# EAGLE design Grove - Tilt Switch v1.1 (EAGLE 6.4)

## Sheet 1 of 2
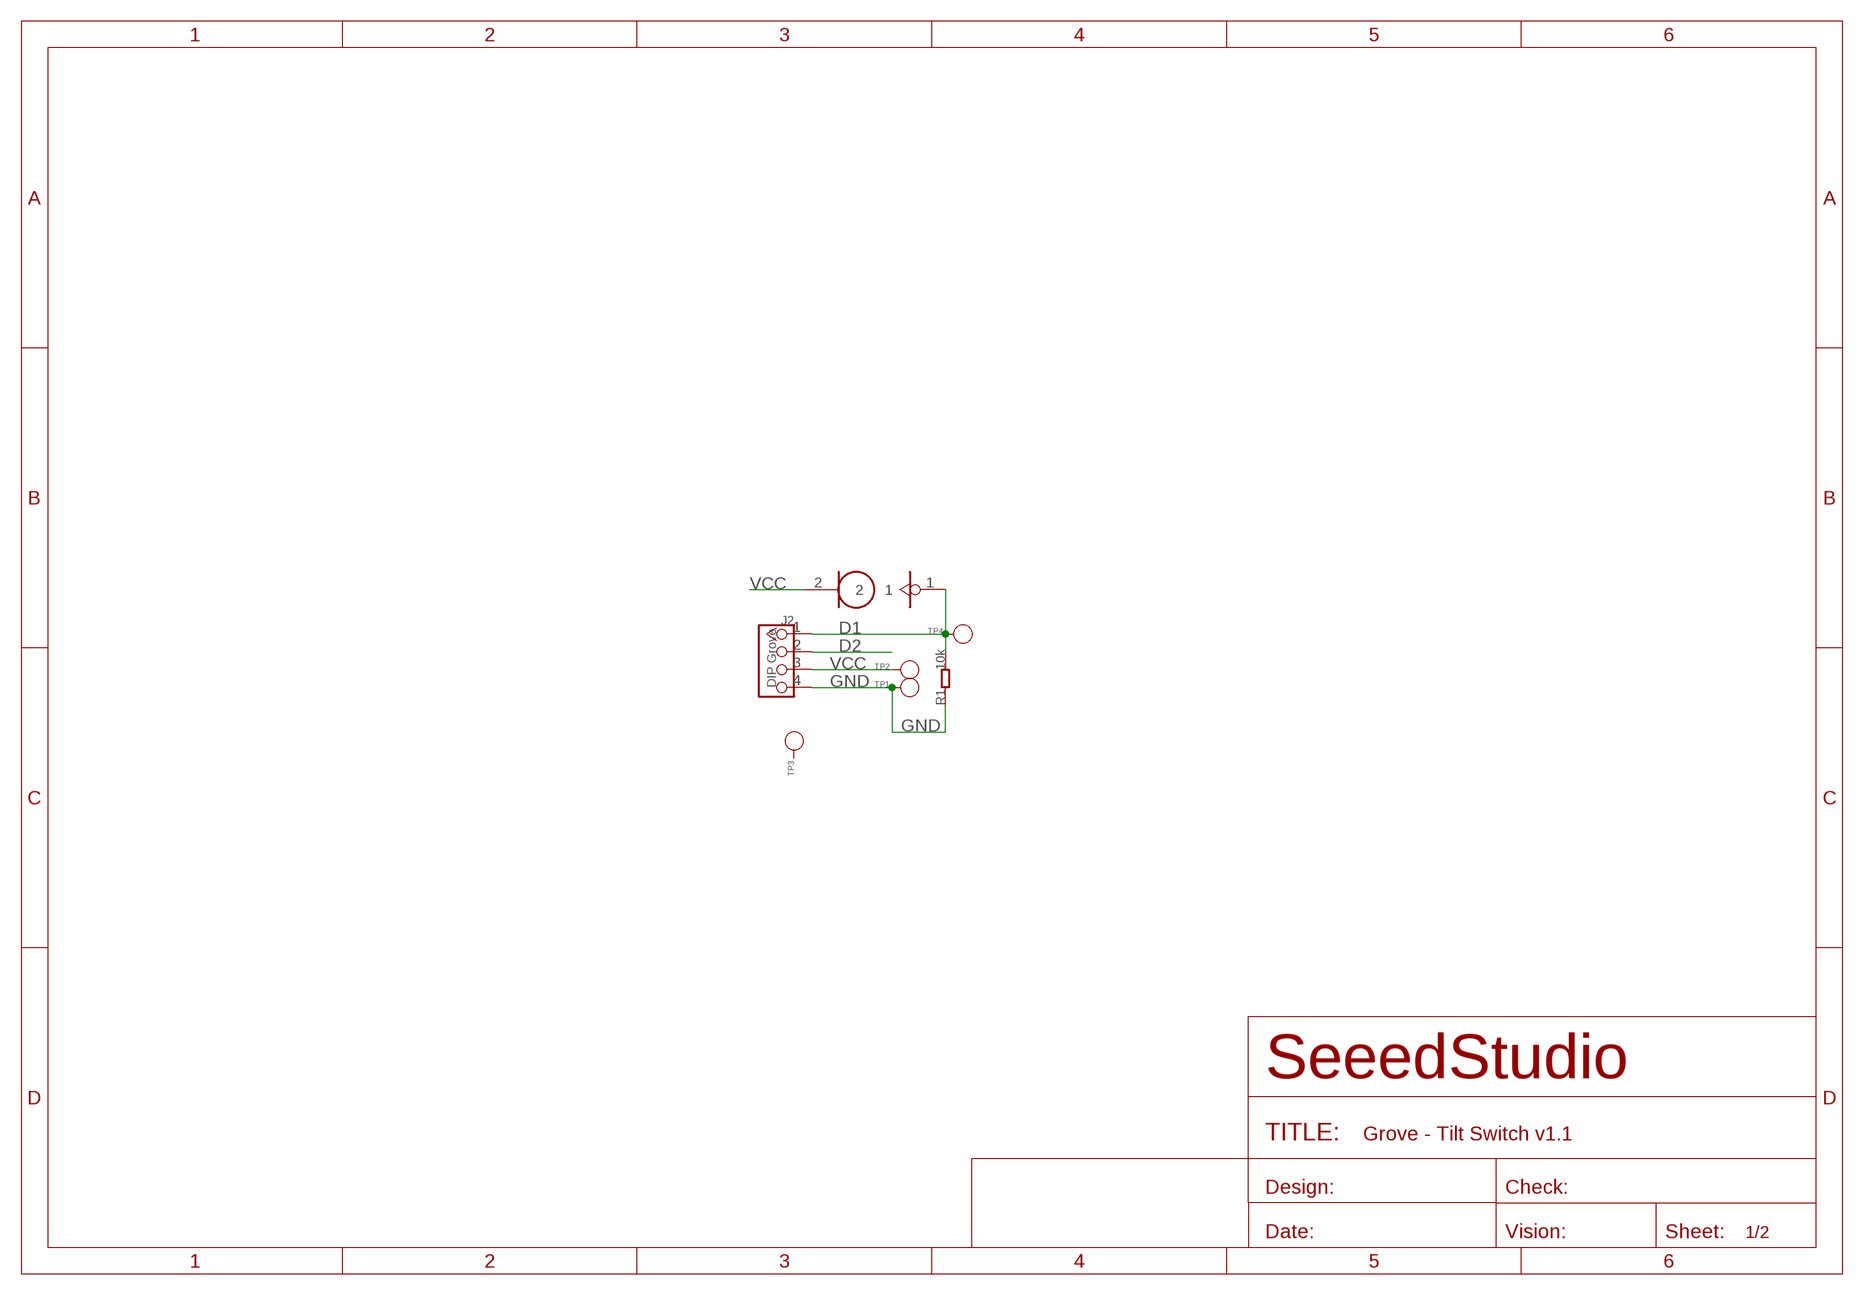
[diagram p0: schematic, sheet 1]

### Parts
J1  TILT  [TILT]
J2  DIP Grove  TWIG-4P-2.0-2.0  [4P-2.0]
R1  10k  005-R0603  [0603]
TP1  PAD-TEST-POINT'4545'  [TP_4545]
TP2  PAD-TEST-POINT'4545'  [TP_4545]
TP3  PAD-TEST-POINT'4545'  [TP_4545]
TP4  PAD-TEST-POINT'4545'  [TP_4545]

### Nets
D1: J1.1 J2.1 R1.2 TP4.T
D2: J2.2
GND: J2.4 R1.1 TP1.T
VCC: J1.2 J2.3 TP2.T
Unconnected: TP3.T

## Sheet 2 of 2
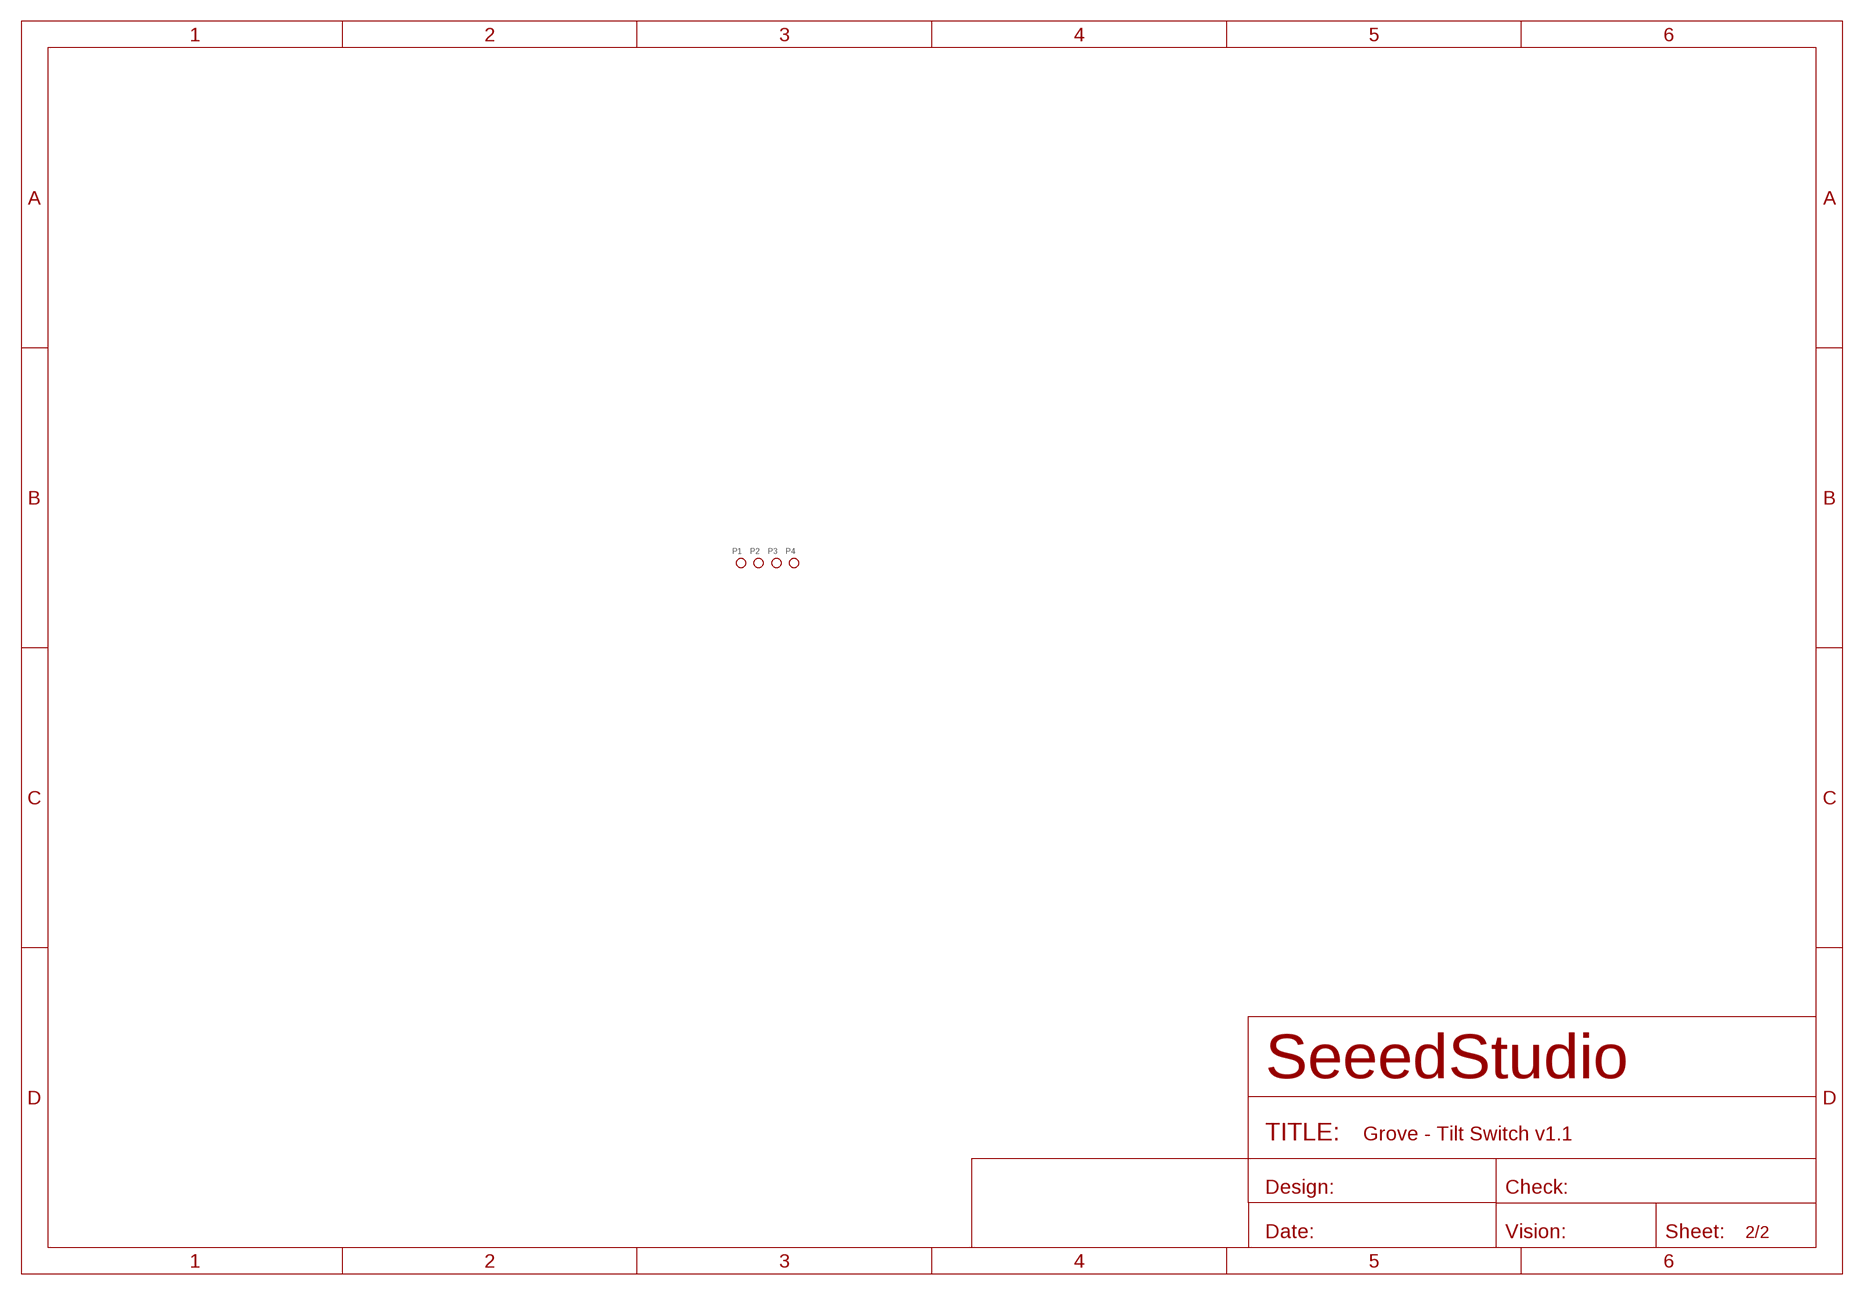
[diagram p1: schematic, sheet 2]

### Parts
P1  PAD-MARK  [ROUND-MARK-1.0]
P2  PAD-MARK  [ROUND-MARK-1.0]
P3  PAD-MARK  [ROUND-MARK-1.0]
P4  PAD-MARK  [ROUND-MARK-1.0]

## Library data of the parts
J1 = Seeed:TILT
J2 = Connector:TWIG-4P-2.0
P1-P4 = Discrete:PAD-MARK; PARTNO: DNP
R1 = Discrete:005-R*
TP1-TP4 = Discrete:PAD-TEST-POINT; PARTNO: DNP

## Board
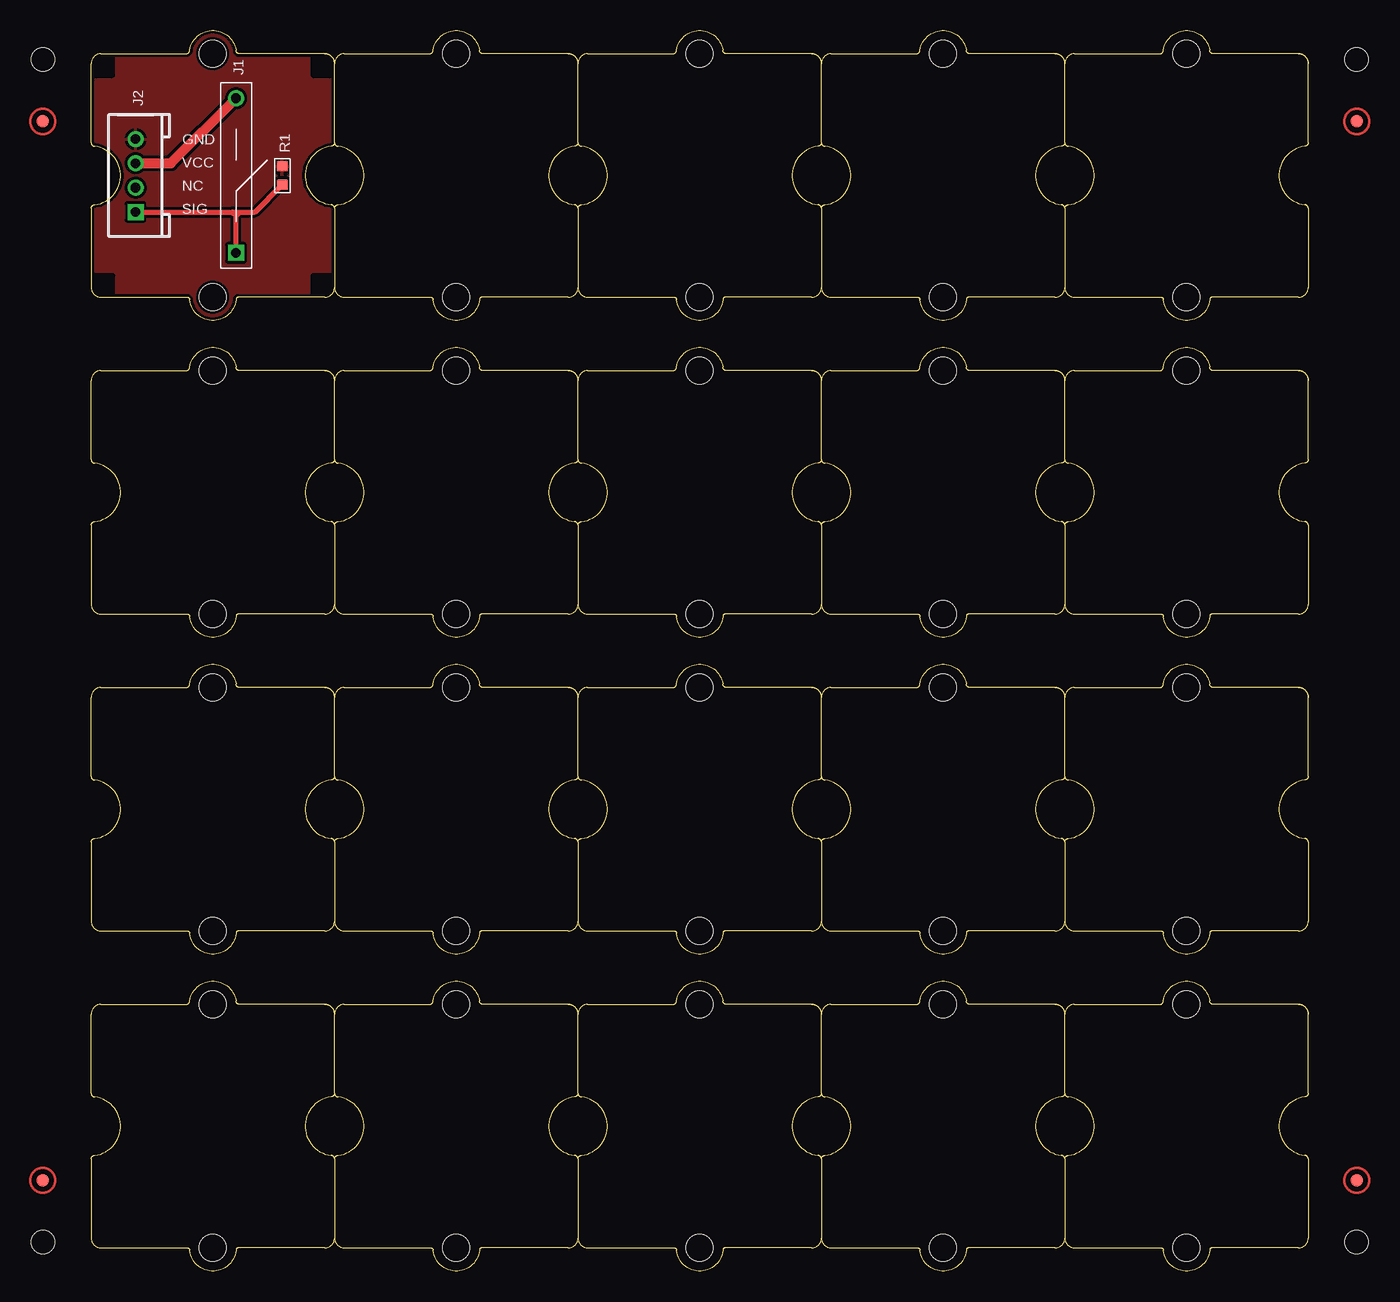
[diagram p2: board, top side]
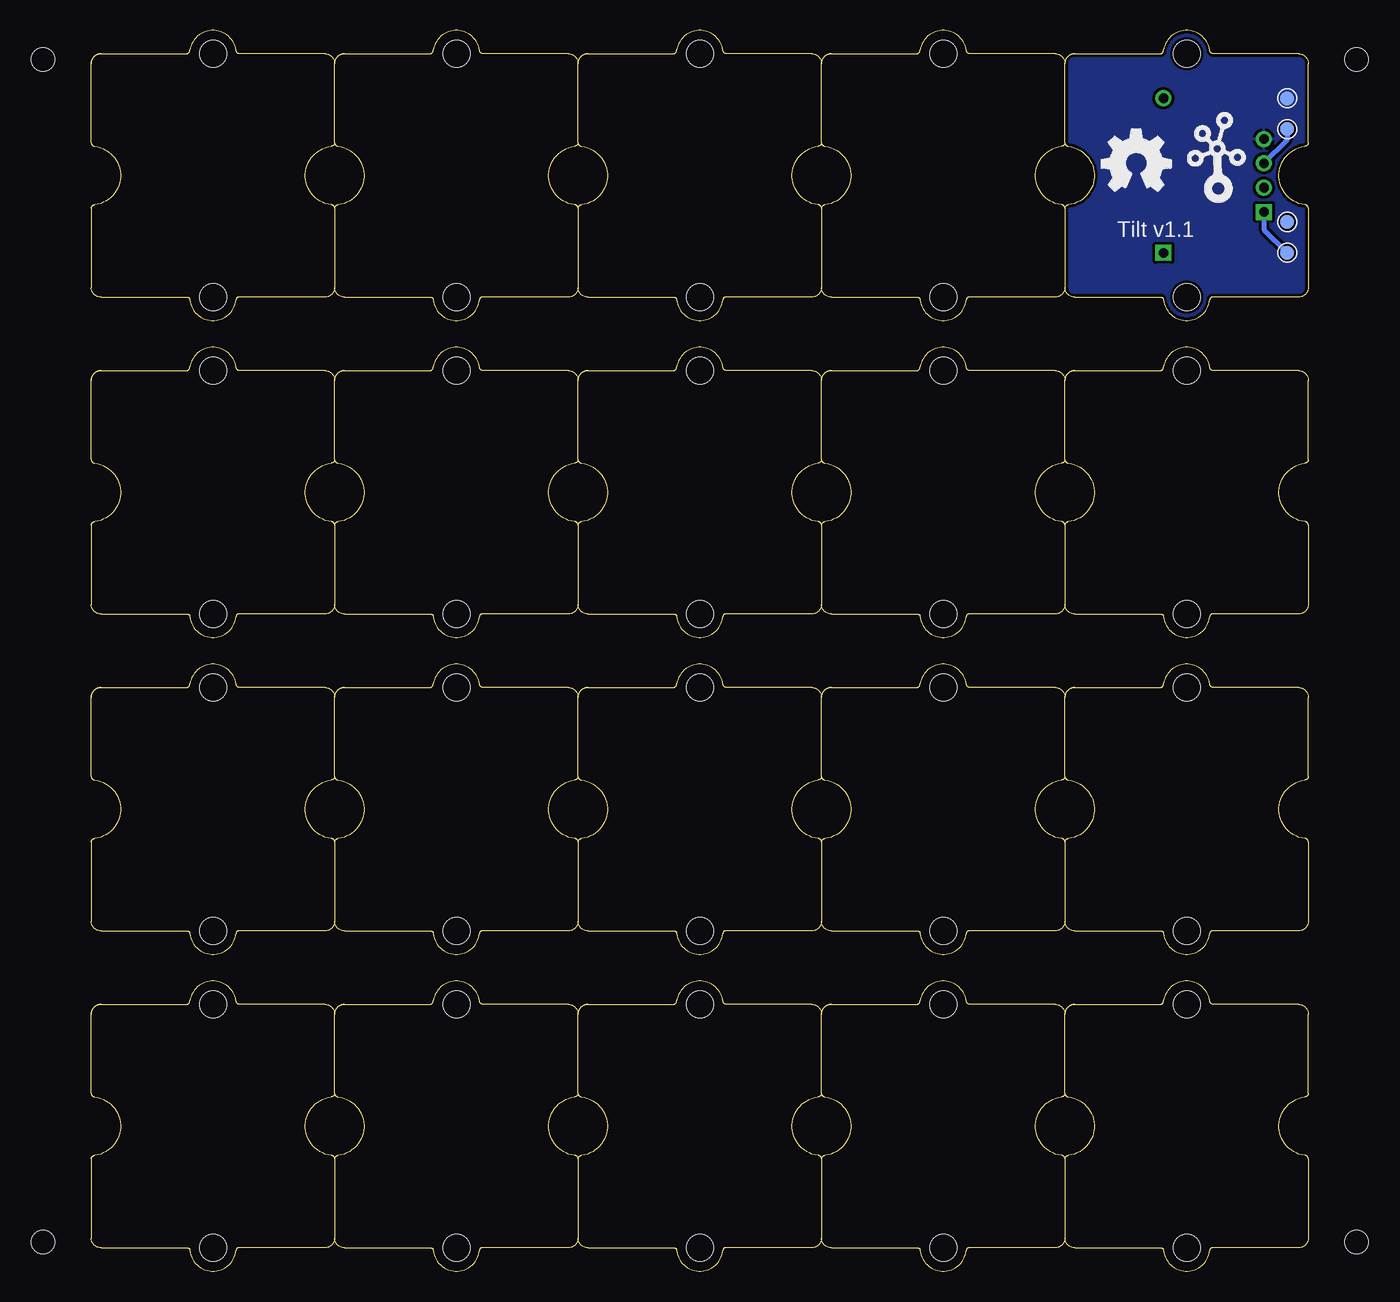
[diagram p3: board, bottom side, seen from below]

Size 100 x 101.93 mm. Coordinates in mm from the lower left corner, seen from the top.
Copper layers (1*16): Top 0.035mm / dielectric 1.5mm / Bottom 0.035mm
Design rules "SeeedStudio_rule_no_angle_090911": minimum track width 6mil, minimum drill 12mil, track to track 6mil, track to pad 6mil, pad to pad 6mil, via to via 6mil, smd to smd 0mil, copper to edge 10mil, drill to drill 10mil, minimum pad ring 10mil, minimum via ring 6mil, stop-mask expansion 2mil, vias tented up to drill 100mil, thermal gap 10mil
Holes 1.91 mm at -3.97,2.38 -3.97,99.54 103.98,99.54 103.98,2.38

### Footprints (pad centres in the part's own frame; a part is rotated, then mirrored left to right if it is on the bottom)
TILT = drill 0.8 square: 1 0,0 | drill 0.8: 2 0,-12.7
4P-2.0 = drill 0.8 pad 1.27 square: 1 -3,0 | drill 0.8 pad 1.27: 2 -1,0; 3 1,0; 4 3,0
ROUND-MARK-1.0 = smd 1.016 x 1.016: P$1 0,0
0603 = smd 0.889 x 0.889: 1 -0.762,0; 2 0.762,0
TP_4545 = smd 1.143 x 1.143: T 0,0
1U-DIM-W/-DRILL = hole 2.2: 0,-10; 0,10

### Placement (x,y rotation side)
J1  11.9,83.66 180 top
J2  3.65,90.01 90 top
P1  -3.97,7.46 0 top  (outside the outline)
P2  103.98,7.46 0 top  (outside the outline)
P3  -3.97,94.46 0 top  (outside the outline)
P4  103.98,94.46 0 top  (outside the outline)
R1  15.71,90.01 270 top
TP1  1.74,96.36 0 bottom
TP2  1.74,93.82 0 bottom
TP3  1.74,86.2 0 bottom
TP4  1.74,83.66 0 bottom
U$2  [1U-DIM-W/-DRILL]  10,90.01 0 top
U$3  [OSHW_FILLX200_NOTEXT]  16.98,88.74 0 bottom
U$5  [TWIGLOGO]  7.46,88.74 0 bottom
U$6  [1U-DIM-W/-DRILL]  10,90.01 0 top
U$7  [1U-DIM-W/-DRILL]  30,90.01 0 top
U$8  [1U-DIM-W/-DRILL]  50,90.01 0 top
U$9  [1U-DIM-W/-DRILL]  70,90.01 0 top
U$10  [1U-DIM-W/-DRILL]  90,90.01 0 top
U$11  [1U-DIM-W/-DRILL]  30,63.98 0 top
U$12  [1U-DIM-W/-DRILL]  50,63.98 0 top
U$13  [1U-DIM-W/-DRILL]  70,63.98 0 top
U$14  [1U-DIM-W/-DRILL]  90,63.98 0 top
U$15  [1U-DIM-W/-DRILL]  10,63.98 0 top
U$16  [1U-DIM-W/-DRILL]  30,37.94 0 top
U$17  [1U-DIM-W/-DRILL]  50,37.94 0 top
U$18  [1U-DIM-W/-DRILL]  70,37.94 0 top
U$19  [1U-DIM-W/-DRILL]  90,37.94 0 top
U$20  [1U-DIM-W/-DRILL]  10,37.94 0 top
U$21  [1U-DIM-W/-DRILL]  30,11.91 0 top
U$22  [1U-DIM-W/-DRILL]  50,11.91 0 top
U$23  [1U-DIM-W/-DRILL]  70,11.91 0 top
U$24  [1U-DIM-W/-DRILL]  90,11.91 0 top
U$25  [1U-DIM-W/-DRILL]  10,11.91 0 top

### Tracks (layer width: path | path; a pad name or v marks a point on that pad's centre or on a via)
D1
  Top 0.406: J2.1 11.6,87.01 | 11.6,87.01 11.9,87.01 | 11.9,87.01 13.48,87.01 R1.2 | J1.1 11.9,86.71 | 11.9,86.71 11.9,87.01 | 11.6,87.01 11.9,86.71 | 11.9,86.71 12.16,86.97
  Bottom 0.406: J2.1 3.65,85.57 TP4.T
GND
  pour Bottom (isolate 0.254): -0.16,102.08 20.16,102.08 20.16,77.95 -0.16,77.95
  pour Top (isolate 0.254): -0.16,102.08 20.16,102.08 20.16,77.95 -0.16,77.95
VCC
  Top 0.813: J2.3 6.55,91.01 J1.2
  Bottom 0.406: TP2.T 1.74,92.92 J2.3

### Text on the board
tPlace: GND | VCC | NC | SIG
bPlace: Tilt v1.1